# Altium schematic sheet DSO_IO.SchDoc: Schematic_Name
size A4; CompanyName: University of Melbourne; Engineer: Your Name Here; DocumentNumber: 1; Revision: 0.1; SheetNumber: 1; SheetTotal: 1; Title_Project: Project_Title; StudentNo: Student No.
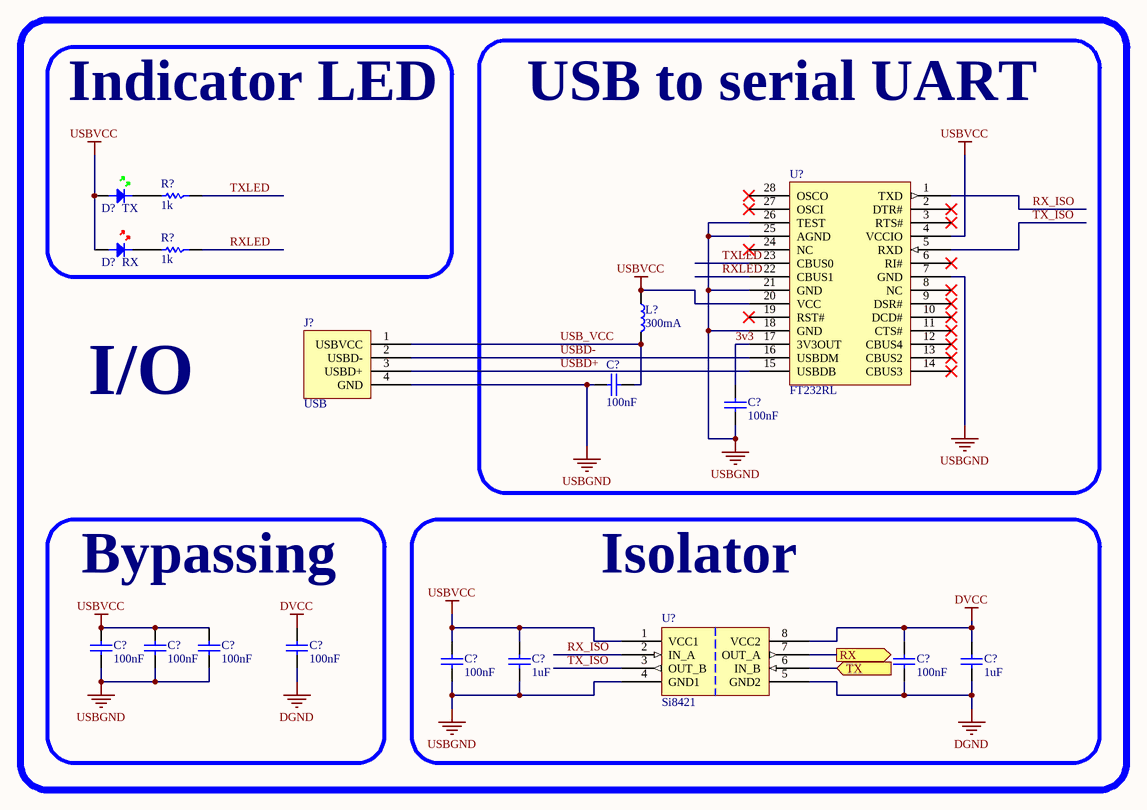
[diagram p0: DSO_IO.SchDoc]

## Parts
(Parts that share a designator on the sheet are numbered #1, #2 ... from top to bottom, then left to right.)
C?#1  100nF  [0805C]
C?#2  100nF  [0805C]
C?#3  100nF  [0805C]
C?#4  100nF  [0805C]
C?#5  100nF  [0805C]
C?#6  100nF  [0805C]
C?#7  100nF  [0805C]
C?#8  1uF  [0805C]
C?#9  100nF  [0805C]
C?#10  1uF  [0805C]
D?#1  TX  [0805D-GREEN]
D?#2  RX  [0805D-RED]
J?  USB  [USBPLUG]
L?  300mA  [0805]
R?#1  1k  [0805]
R?#2  1k  [0805]
U?#1  FT232RL  [SSOP-28]
U?#2  Si8421  [SOIC-8]

## Blocks framed on the sheet
I/O: J?
Indicator LED: D?#1 D?#2 R?#1 R?#2
USB to serial UART: C?#1 C?#2 L? U?#1
Bypassing: C?#3-C?#6
Isolator: C?#7-C?#10 U?#2

## Ports
RX (out), TX (in)

## Nets
DGND: C?#6.2 C?#9.2 C?#10.2 U?#2.5(GND2)
DVCC: C?#6.1 C?#9.1 C?#10.1 U?#2.8(VCC2)
USBGND: C?#1.2 C?#2.2 C?#3.2 C?#4.2 C?#5.2 C?#7.2 C?#8.2 J?.4(GND) U?#1.7(GND) U?#1.18(GND) U?#1.21(GND) U?#1.25(AGND) U?#1.26(TEST) U?#2.4(GND1)
USBVCC: C?#3.1 C?#4.1 C?#5.1 C?#7.1 C?#8.1 D?#1.A D?#2.A L?.1 U?#1.4(VCCIO) U?#1.20(VCC) U?#2.1(VCC1)
3v3: C?#2.1 U?#1.17(3V3OUT)
RX: U?#2.7(OUT_A) ; port RX
RX_ISO: U?#1.1(TXD) U?#2.2(IN_A)
RXLED: R?#2.1 U?#1.22(CBUS1)
TX: U?#2.6(IN_B) ; port TX
TX_ISO: U?#1.5(RXD) U?#2.3(OUT_B)
TXLED: R?#1.1 U?#1.23(CBUS0)
USB_VCC: C?#1.1 J?.1(USBVCC) L?.2
USBD+: J?.3(USBD+) U?#1.15(USBDB)
USBD-: J?.2(USBD-) U?#1.16(USBDM)
NetD?#1_K: D?#1.K R?#1.2
NetD?#2_K: D?#2.K R?#2.2

Not connected (* = marked no-connect by the designer): U?#1 2(DTR#)* 3(RTS#)* 6(RI#)* 8(NC)* 9(DSR#)* 10(DCD#)* 11(CTS#)* 12(CBUS4)* 13(CBUS2)* 14(CBUS3)* 19(RST#)* 24(NC)* 27(OSCI)* 28(OSCO)*

## Library data of the parts
C?#1-C?#10 = C: Capacitor; Reviewed by: RM - 2018/08/05; Revision: July-2002: Re-released for DXP Platform.; Supplier 1: *; Supplier Part Number 1: *
  C?#1-C?#7 C?#9: Value: 100nF
  C?#8 C?#10: Value: 1uF
D?#1 = LED GREEN: Light Emitting Diode; Reviewed by: RM - 2018/08/05; Revision: July-2002: Re-released for DXP Platform.; Supplier 1: Digi-Key; Supplier Part Number 1: 160-1423-1-ND
D?#2 = LED RED: Light Emitting Diode; Reviewed by: RM - 2018/08/05; Revision: July-2002: Re-released for DXP Platform.; Supplier 1: Digi-Key; Supplier Part Number 1: 475-1415-1-ND
J? = USBPLUG: USB B Type Connector; Reviewed by: RM - 2018/08/05; Supplier 1: Digi-Key; Supplier Part Number 1: 609-1039-ND
L? = I: Inductor; Reviewed by: RM - 2018/08/05; Value: 300mA; Supplier 1: *; Supplier Part Number 1: *
R?#1 R?#2 = R: Resistor; Reviewed by: RM - 2018/08/05; Value: 1k; Supplier 1: *; Suppler Part Number 1: *
U?#1 = FT232RL: USB to Serial bridge; Reviewed by: RM - 2018/08/05; Supplier 1: Digi-Key; Supplier Part Number 1: 768-1007-1-ND
U?#2 = Si8421: Dual Channel Digital Isolator Both Ways; Reviewed by: RM - 2018/08/05; Supplier 1: Digi-Key; Supplier Part Number 1: 336-1755-5-ND